# EAGLE design ads1115_2 (EAGLE 7.7.0)
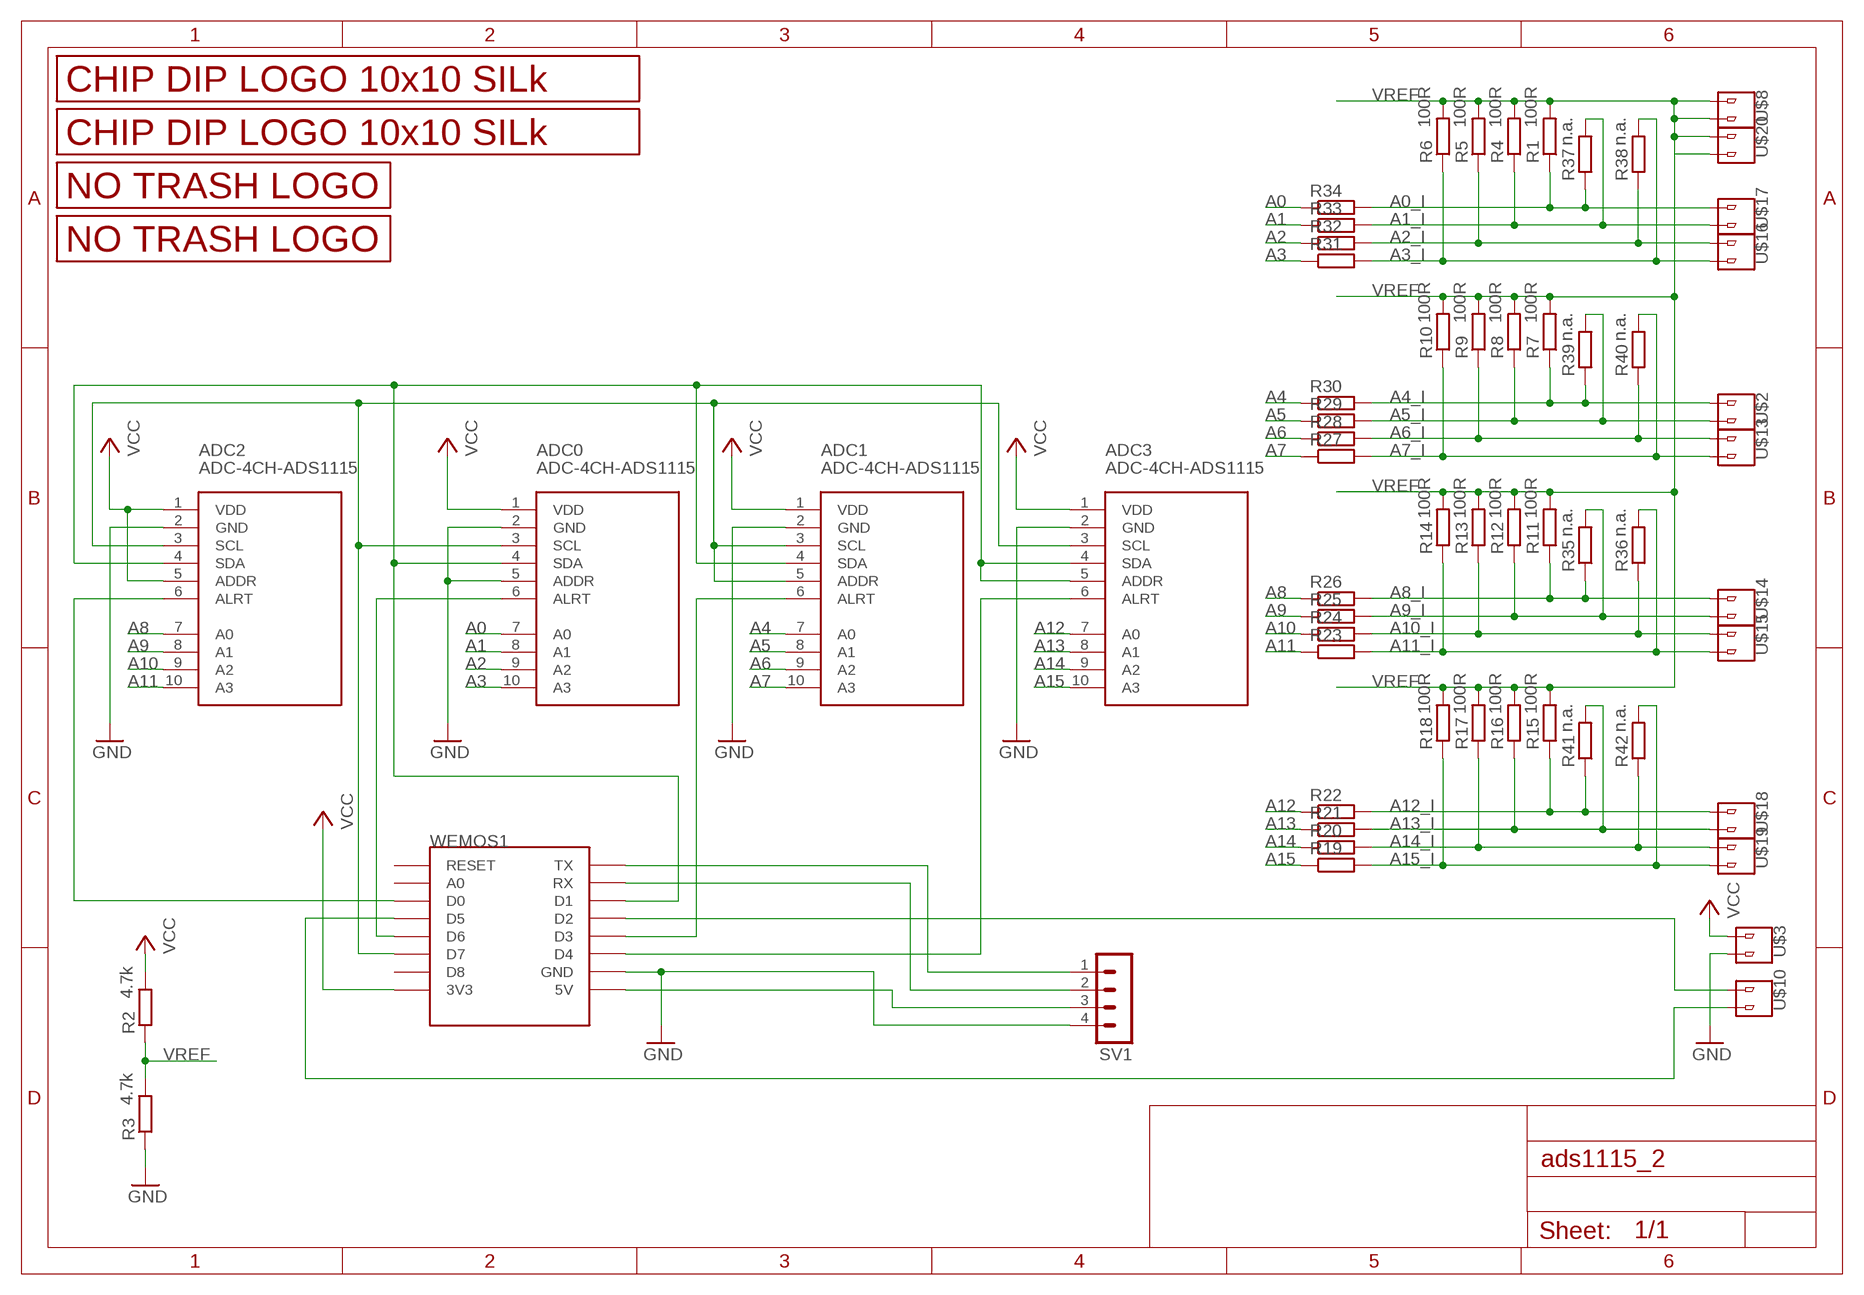
[diagram p0: schematic, sheet 1]

## Parts
ADC0  ADC-4CH-ADS1115  [ADC-4CH-ADS1115_NO]
ADC1  ADC-4CH-ADS1115  [ADC-4CH-ADS1115_NO]
ADC2  ADC-4CH-ADS1115  [ADC-4CH-ADS1115_NO]
ADC3  ADC-4CH-ADS1115  [ADC-4CH-ADS1115_NO]
R1  100R  R-EU_M0805  [M0805]
R2  4.7k  R-EU_M0805  [M0805]
R3  4.7k  R-EU_M0805  [M0805]
R4  100R  R-EU_M0805  [M0805]
R5  100R  R-EU_M0805  [M0805]
R6  100R  R-EU_M0805  [M0805]
R7  100R  R-EU_M0805  [M0805]
R8  100R  R-EU_M0805  [M0805]
R9  100R  R-EU_M0805  [M0805]
R10  100R  R-EU_M0805  [M0805]
R11  100R  R-EU_M0805  [M0805]
R12  100R  R-EU_M0805  [M0805]
R13  100R  R-EU_M0805  [M0805]
R14  100R  R-EU_M0805  [M0805]
R15  100R  R-EU_M0805  [M0805]
R16  100R  R-EU_M0805  [M0805]
R17  100R  R-EU_M0805  [M0805]
R18  100R  R-EU_M0805  [M0805]
R19  1k  R-EU_M0805  [M0805]
R20  1k  R-EU_M0805  [M0805]
R21  1k  R-EU_M0805  [M0805]
R22  1k  R-EU_M0805  [M0805]
R23  1k  R-EU_M0805  [M0805]
R24  1k  R-EU_M0805  [M0805]
R25  1k  R-EU_M0805  [M0805]
R26  1k  R-EU_M0805  [M0805]
R27  1k  R-EU_M0805  [M0805]
R28  1k  R-EU_M0805  [M0805]
R29  1k  R-EU_M0805  [M0805]
R30  1k  R-EU_M0805  [M0805]
R31  1k  R-EU_M0805  [M0805]
R32  1k  R-EU_M0805  [M0805]
R33  1k  R-EU_M0805  [M0805]
R34  1k  R-EU_M0805  [M0805]
R35  n.a.  R-EU_M0805  [M0805]
R36  n.a.  R-EU_M0805  [M0805]
R37  n.a.  R-EU_M0805  [M0805]
R38  n.a.  R-EU_M0805  [M0805]
R39  n.a.  R-EU_M0805  [M0805]
R40  n.a.  R-EU_M0805  [M0805]
R41  n.a.  R-EU_M0805  [M0805]
R42  n.a.  R-EU_M0805  [M0805]
SV1  MA04-1  [MA04-1]
U$1  LOGO_10X10_SILK  [LOGO2_10X10_SILK]
U$2  V1  2_PIN_CONNECTOR  [2_SCREW_PIN]
U$3  V1  2_PIN_CONNECTOR  [2_SCREW_PIN]
U$4  LOGO_NO_TRASHNO_TRASH  [LOGO_ROHS_NO_TRASH]
U$8  V1  2_PIN_CONNECTOR  [2_SCREW_PIN]
U$9  LOGO_NO_TRASHROHS  [LOGO_ROHS_SYM]
U$10  V1  2_PIN_CONNECTOR  [2_SCREW_PIN]
U$11  LOGO_10X10_SILK  [LOGO2_10X10_SILK]
U$13  V1  2_PIN_CONNECTOR  [2_SCREW_PIN]
U$14  V1  2_PIN_CONNECTOR  [2_SCREW_PIN]
U$15  V1  2_PIN_CONNECTOR  [2_SCREW_PIN]
U$16  V1  2_PIN_CONNECTOR  [2_SCREW_PIN]
U$17  V1  2_PIN_CONNECTOR  [2_SCREW_PIN]
U$18  V1  2_PIN_CONNECTOR  [2_SCREW_PIN]
U$19  V1  2_PIN_CONNECTOR  [2_SCREW_PIN]
U$20  V1  2_PIN_CONNECTOR  [2_SCREW_PIN]
WEMOS1  WEMOS-D1-MINITXT  [WEMOS-D1-MINI]

## Nets
A0: ADC0.7(A0) R34.1
A0_I: R1.1 R34.2 R37.1 U$17.P$1
A1: ADC0.8(A1) R33.1
A1_I: R4.1 R33.2 R37.2 U$17.P$2
A2: ADC0.9(A2) R32.1
A2_I: R5.1 R32.2 R38.1 U$16.P$1
A3: ADC0.10(A3) R31.1
A3_I: R6.1 R31.2 R38.2 U$16.P$2
A4: ADC1.7(A0) R30.1
A4_I: R7.1 R30.2 R39.1 U$2.P$1
A5: ADC1.8(A1) R29.1
A5_I: R8.1 R29.2 R39.2 U$2.P$2
A6: ADC1.9(A2) R28.1
A6_I: R9.1 R28.2 R40.1 U$13.P$1
A7: ADC1.10(A3) R27.1
A7_I: R10.1 R27.2 R40.2 U$13.P$2
A8: ADC2.7(A0) R26.1
A8_I: R11.1 R26.2 R35.1 U$14.P$1
A9: ADC2.8(A1) R25.1
A9_I: R12.1 R25.2 R35.2 U$14.P$2
A10: ADC2.9(A2) R24.1
A10_I: R13.1 R24.2 R36.1 U$15.P$1
A11: ADC2.10(A3) R23.1
A11_I: R14.1 R23.2 R36.2 U$15.P$2
A12: ADC3.7(A0) R22.1
A12_I: R15.1 R22.2 R41.1 U$18.P$1
A13: ADC3.8(A1) R21.1
A13_I: R16.1 R21.2 R41.2 U$18.P$2
A14: ADC3.9(A2) R20.1
A14_I: R17.1 R20.2 R42.1 U$19.P$1
A15: ADC3.10(A3) R19.1
A15_I: R18.1 R19.2 R42.2 U$19.P$2
GND: ADC0.2(GND) ADC0.5(ADDR) ADC1.2(GND) ADC2.2(GND) ADC3.2(GND) R3.1 SV1.4 U$3.P$2 WEMOS1.GND
N$1: SV1.1 WEMOS1.TX
N$2: SV1.2 WEMOS1.RX
N$3: SV1.3 WEMOS1.5V
N$4: ADC0.6(ALRT) WEMOS1.D6
N$5: U$10.P$2 WEMOS1.D5
N$7: U$10.P$1 WEMOS1.D2
N$9: ADC0.4(SDA) ADC1.4(SDA) ADC2.4(SDA) ADC3.4(SDA) ADC3.5(ADDR) WEMOS1.D1
N$10: ADC3.6(ALRT) WEMOS1.D4
N$12: ADC1.6(ALRT) WEMOS1.D3
N$13: ADC0.3(SCL) ADC1.3(SCL) ADC1.5(ADDR) ADC2.3(SCL) ADC3.3(SCL) WEMOS1.D7
N$15: ADC2.6(ALRT) WEMOS1.D0
VCC: ADC0.1(VDD) ADC1.1(VDD) ADC2.1(VDD) ADC2.5(ADDR) ADC3.1(VDD) R2.2 U$3.P$1 WEMOS1.3V3
VREF: R1.2 R2.1 R3.2 R4.2 R5.2 R6.2 R7.2 R8.2 R9.2 R10.2 R11.2 R12.2 R13.2 R14.2 R15.2 R16.2 R17.2 R18.2 U$8.P$1 U$8.P$2 U$20.P$1 U$20.P$2
Unconnected: WEMOS1.A0 WEMOS1.D8 WEMOS1.RESET

## Library data of the parts
ADC0 ADC1-ADC3 = diy-modules:ADC-4CH-ADS1115: 4 Channel 16-Bit Analog-to-Digital Converter based on ADS1115 chip Arduino ADS1115 Getting Started Tutorial is available here: http://henrysbench.capnfatz.com/henrys-bench/arduino-voltage-measurements/arduino-ads1115-module-getting-started-tutorial/ ADS1115 datasheet is available here: http://www.ti.com/lit/ds/symlink/ads1115.pdf Click here to find device on ebay.com <http://www.ebay.com/sch/ads1115+module>
R1-R42 = rcl:R-EU_: RESISTOR, European symbol
SV1 = con-lstb:MA04-1: PIN HEADER; OC_FARNELL: unknown; OC_NEWARK: unknown
U$1 U$11 = JKW_CHIP:LOGO_10X10_SILK
U$2 U$3 U$8 U$10 U$13-U$20 = JKW_CHIP:2_PIN_CONNECTOR
U$4 U$9 = JKW_CHIP:LOGO_NO_TRASH
WEMOS1 = esp8266modules:WEMOS-D1-MINI: WeMos.cc D1 mini ESP8266 module

## Board
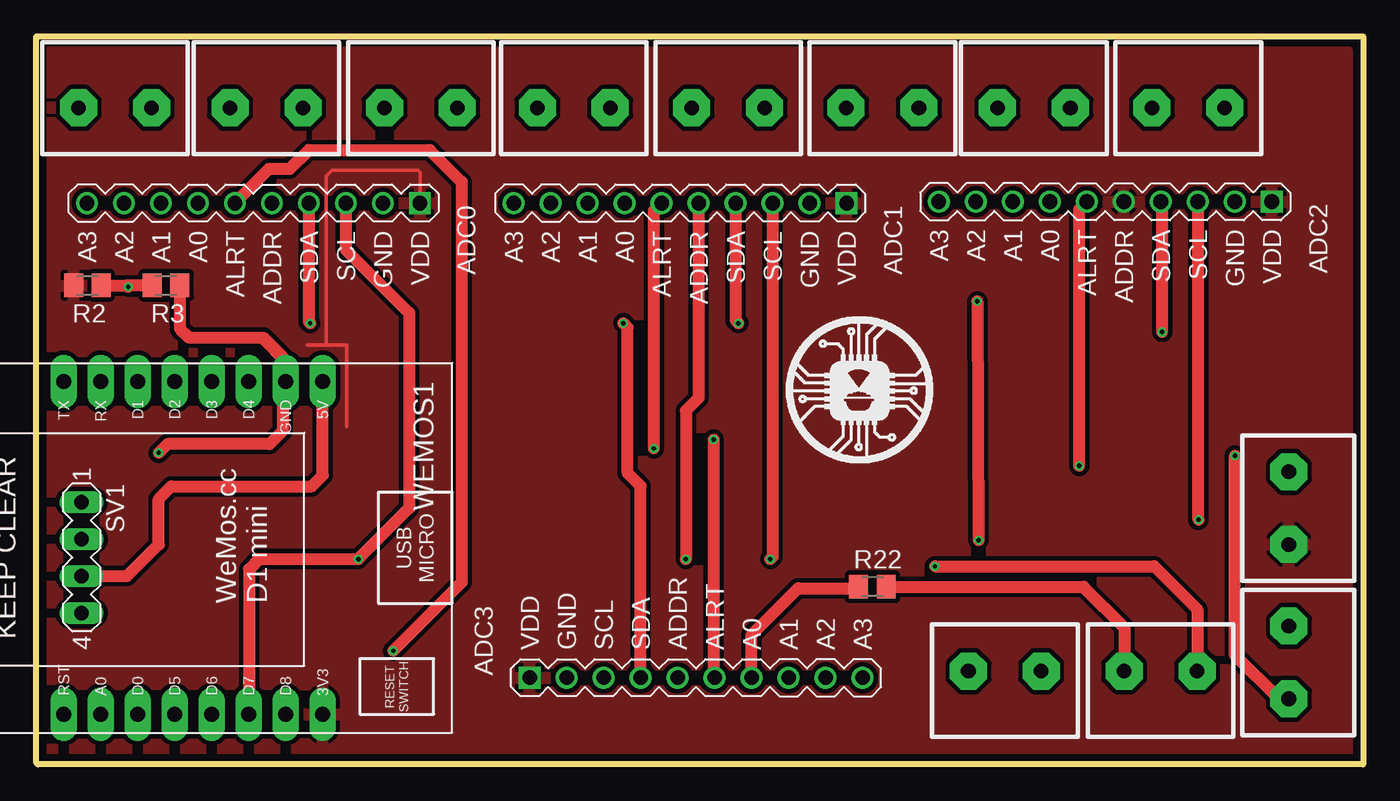
[diagram p1: board, top side]
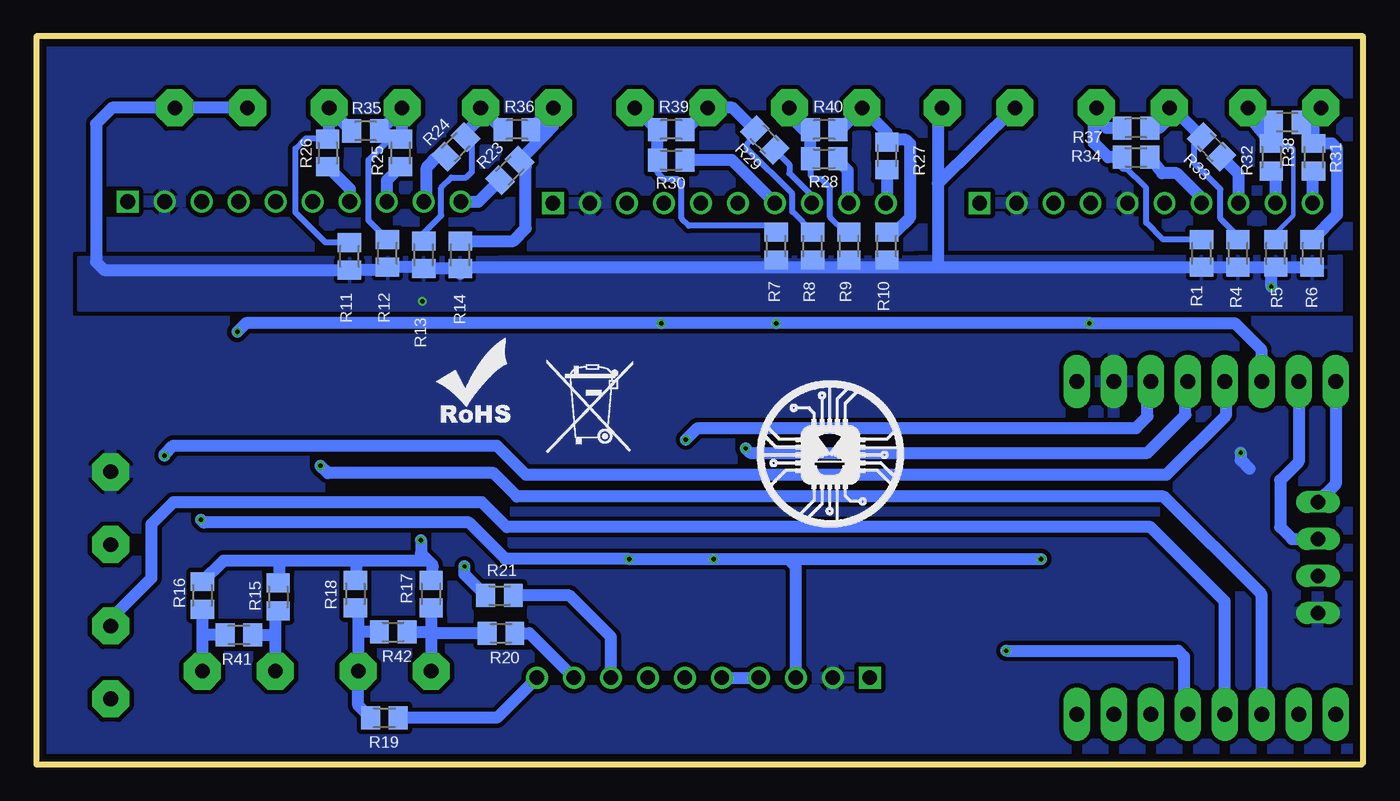
[diagram p2: board, bottom side, seen from below]

Size 91.1 x 50 mm. Coordinates in mm from the lower left corner, seen from the top.
Outline: 0,0.1 0,50 91.1,50 91.1,0 0.1,0
Copper layers (1*16): Top 0.035mm / dielectric 1.6mm / Bottom 0.035mm
Design rules "Elecrow_2-layer_PCB_eagle_rule": minimum track width 6mil, minimum drill 12mil, track to track 6mil, track to pad 6mil, pad to pad 6mil, via to via 8mil, smd to smd 0mil, copper to edge 20mil, drill to drill 10mil, minimum pad ring 6mil, minimum via ring 6mil, stop-mask expansion 0mil, vias tented up to drill 100mil, thermal gap 10mil

### Footprints (pad centres in the part's own frame; a part is rotated, then mirrored left to right if it is on the bottom)
ADC-4CH-ADS1115_NO = drill 1 square: 1 -6.35,11.43 | drill 1: 2 -6.35,8.89; 3 -6.35,6.35; 4 -6.35,3.81; 5 -6.35,1.27; 6 -6.35,-1.27; 7 -6.35,-3.81; 8 -6.35,-6.35; 9 -6.35,-8.89; 10 -6.35,-11.43
M0805 = smd 1.3 x 1.6: 1 -0.95,0; 2 0.95,0
MA04-1 = drill 1.016 long: 1 -3.81,0; 2 -1.27,0; 3 1.27,0; 4 3.81,0
2_SCREW_PIN = drill 1 pad 2.54 octagon: P$1 -2.5,0.5; P$2 2.5,0.5
WEMOS-D1-MINI = drill 1.016 pad 1.829 long: 3V3 -10.16,-10.16; 5V 12.7,-10.16; A0 -10.16,5.08; D0 -10.16,2.54; D1 12.7,2.54; D2 12.7,0; D3 12.7,-2.54; D4 12.7,-5.08; D5 -10.16,0; D6 -10.16,-2.54; D7 -10.16,-5.08; D8 -10.16,-7.62; GND 12.7,-7.62; RESET -10.16,7.62; RX 12.7,5.08; TX 12.7,7.62

### Placement (x,y rotation side)
ADC0  14.9,32.2 270 top
ADC1  44.2,32.2 270 top
ADC2  73.4,32.3 270 top
ADC3  45.3,12.3 90 top
R1  11.1,35.1 270 bottom
R2  3.5,32.9 180 top
R3  8.9,32.9 180 top
R4  8.6,35.1 270 bottom
R5  6,35.1 270 bottom
R6  3.5,35.1 270 bottom
R7  40.3,35.6 270 bottom
R8  37.8,35.6 270 bottom
R9  35.3,35.6 270 bottom
R10  32.7,35.6 270 bottom
R11  69.6,34.9 270 bottom
R12  67,35.1 270 bottom
R13  64.5,35 270 bottom
R14  62,35 270 bottom
R15  74.5,11.5 90 bottom
R16  79.7,11.6 90 bottom
R17  64,11.7 90 bottom
R18  69.2,11.7 90 bottom
R19  67.2,3.2 180 bottom
R20  59.2,9 180 bottom
R21  59.3,11.6 180 bottom
R22  57.4,12.2 0 top
R23  58.6,40.8 45 bottom
R24  62.3,42.4 45 bottom
R25  66.1,42 90 bottom
R26  71.1,42 90 bottom
R27  32.7,41.8 90 bottom
R28  37,41.6 180 bottom
R29  41.1,42.9 135 bottom
R30  47.5,41.5 180 bottom
R31  3.4,41.7 90 bottom
R32  6.3,41.7 90 bottom
R33  10.4,42.4 135 bottom
R34  15.6,41.7 180 bottom
R35  68.5,43.5 0 bottom
R36  58.1,43.6 0 bottom
R37  15.6,43.7 0 bottom
R38  5.2,44.1 0 bottom
R39  47.5,43.6 0 bottom
R40  37,43.6 0 bottom
R41  77.2,8.9 180 bottom
R42  66.6,9.1 180 bottom
SV1  3.1,14.2 270 top
U$1  41.6,16.3 0 bottom
U$2  47.5,45.6 180 top
U$3  86.5,17.6 90 top
U$4  56.1,21.4 0 bottom
U$8  26.4,45.6 180 top
U$9  64.1,23.4 0 bottom
U$10  86.5,7 90 top
U$11  51.5,20.7 0 top
U$13  36.9,45.6 180 top
U$14  68.5,45.6 180 top
U$15  58.1,45.6 180 top
U$16  5.4,45.6 180 top
U$17  15.8,45.6 180 top
U$18  77.2,5.9 0 top
U$19  66.5,5.9 0 top
U$20  79.1,45.6 180 top
WEMOS1  9.5,13.6 90 top

### Tracks (layer width: path | path; a pad name or v marks a point on that pad's centre or on a via)
A0
  Bottom 0.813: ADC0.7 11.09,38.89 12.8,40.6 13.8,40.6 R34.1
A0_I
  Bottom 0.406: R1.1 13.75,36.05 14.9,37.2 14.9,39.6 16.4,41.1
  Bottom 0.813: 18.5,44.6 18.5,42.7 17.5,41.7 R34.2 16.55,41.25 16.4,41.1 | 18.5,44.6 18.5,44.9 U$17.P$1 | R37.1 17.6,43.7 18.5,44.6
A1
  Bottom 0.813: ADC0.8 8.55,40.55 R33.1
A1_I
  Bottom 0.406: R4.1 8.6,36.3 9.8,37.5 9.8,39.5 11.6,41.3 11.6,42.54 R33.2
  Bottom 0.813: U$17.P$2 13.1,45.1 12.85,44.85 | 12.85,44.85 R33.2 | R37.2 14,43.7 12.85,44.85
A2
  Bottom 0.813: ADC0.9 6.01,40.74 R32.1
A2_I
  Bottom 0.305: R5.1 6,36.5 4.8,37.7 4.8,42.3 5,42.5 5.85,42.5 R32.2
  Bottom 0.813: U$16.P$1 7.9,44.55 7.52,44.17 | 7.52,44.17 R32.2 | R38.1 7.4,44.3 7.52,44.17
A3
  Bottom 0.813: ADC0.10 3.47,40.68 R31.1
A3_I
  Bottom 0.813: 3.4,44.3 R31.2 2.15,42.65 1.8,42.3 1.8,37.75 R6.1 | 3.4,44.3 3.4,44.6 U$16.P$2 | R38.2 3.4,44.3
A4
  Bottom 0.813: 40.3,38.46 ADC1.7 43.34,41.5 R30.1
A4_I
  Bottom 0.406: R7.1 40.75,37 46.3,37 46.8,37.5 46.8,39.9 47.1,40.2 48,40.2 48.45,40.65 R30.2
  Bottom 0.813: U$2.P$1 48.5,43.6 R39.1 R30.2
A5
  Bottom 0.406: R29.1 39.4,41.2 39.4,40.6 37.85,39.05 ADC1.8
  Bottom 0.813: 37.8,38.5 ADC1.8
A5_I
  Bottom 0.406: R8.1 39.2,37.95 39.2,39.2 42.3,42.3 42.3,42.6 41.77,43.13 R29.2
  Bottom 0.813: R39.2 46.5,43.6 U$2.P$2 | 44.2,45.1 U$2.P$2 | R29.2 43.3,45.1 U$2.P$2
A6
  Bottom 0.813: ADC1.9 35.4,38.64 35.4,40.8 36.05,41.45 R28.1
A6_I
  Bottom 0.406: R9.1 35.55,36.55 36.6,37.6 36.6,39.6 37.2,40.2 37.7,40.2 37.9,40.4 37.9,41.55 R28.2
  Bottom 0.813: R28.2 37.95,43.1 | 37.95,43.1 R40.1 | U$13.P$1 39.4,44.55 37.95,43.1
A7
  Bottom 0.813: 32.7,38.48 ADC1.10 32.7,38.62 R27.1
A7_I
  Bottom 0.813: R10.1 32.15,36.55 31.1,37.6 31.1,42.6 31.4,42.9 32.55,42.9 R27.2 32.7,43.4 U$13.P$2 35.9,43.6 R40.2
A8
  Bottom 0.813: R26.1 69.59,39.54 ADC2.7
A8_I
  Bottom 0.406: R11.1 71.25,35.85 73.3,37.9 73.3,42.3 72.6,43 71.15,43 R26.2
  Bottom 0.813: R35.1 71,45.05 U$14.P$1 71,43.05 R26.2
A9
  Bottom 0.813: R25.1 67.05,40.1 ADC2.8
A9_I
  Bottom 0.406: R12.1 68.3,37.35 68.3,41.5 67.1,42.7 67.1,43.05 R35.2
  Bottom 0.813: R35.2 66,45.05 U$14.P$2 66,43.05 R25.2
A10
  Bottom 0.813: ADC2.9 64.3,38.86 64.3,41 63.57,41.73 R24.1
A10_I
  Bottom 0.406: R13.1 64.5,36.5 63.3,37.7 63.3,39.6 62.6,40.3 61.6,40.3 61.2,40.7 61.2,42.64 R24.2
  Bottom 0.813: R36.1 59.1,43.6 60.25,44.75 | 60.25,44.75 U$15.P$1 | R24.2 61.63,43.37 60.25,44.75
A11
  Bottom 0.813: ADC2.10 60.75,38.65 R23.1
A11_I
  Bottom 0.813: U$15.P$2 55.6,43.9 | 55.6,43.9 R23.2 57.5,41.04 57.5,36.8 58.35,35.95 R14.1 | 55.6,43.9 56,43.5 56.2,43.5 55.6,44.1 55.6,45.2 57.15,43.65 R36.2
A12
  Top 0.813: ADC3.7 49.11,8.91 52.3,12.1 56.35,12.1 R22.1
A12_I
  Top 0.813: R22.2 71.9,12.2 74.7,9.4 U$18.P$1
  Bottom 0.813: R15.1 74.7,10.35 74.7,8.7 | 74.7,8.7 U$18.P$1 | R41.1 74.9,8.9 74.7,8.7
A13
  Bottom 0.813: ADC3.8 51.65,8.75 54.5,11.6 R21.1
A13_I  (via drill 0.3)
  Top 0.813: v61.7,13.6 76.75,13.6 R16.1 U$18.P$2
  Bottom 0.813: R16.1 79.7,8.7 | 79.7,8.7 U$18.P$2 | R21.2 61.7,13.05 v61.7,13.6 | R41.2 79.5,8.9 79.7,8.7
A14
  Bottom 0.813: R20.1 57.24,9 ADC3.9
A14_I
  Bottom 0.813: R17.1 64,9.2 | 64,9.2 64,9 | 64,9 U$19.P$1 | R20.2 64,9 | R42.1 64.1,9.1 64,9.2
A15
  Bottom 0.813: ADC3.10 59.48,3.2 R19.1
A15_I
  Bottom 0.813: R18.1 69,10.55 69,9.1 | 69,9.1 U$19.P$2 69,4.05 R19.2 | R42.2 69,9.1
GND  (via drill 0.3)
  Top 0.813: R3.1 9.85,29.95 10.5,29.3 15.5,29.3 | 15.5,29.3 17.12,27.68 WEMOS1.GND | 15.5,29.3 15.6,29.3 16.9,28 16.9,22.9 16,22 9,22 v8.4,21.4
  Bottom 0.813: v8.4,21.4 8.4,20.9 7.8,20.3
  pour Bottom (isolate 0.305, rank 2): 0.6,0.6 0.6,49.3 90.4,49.3 90.4,0.7 1.4,0.7
N$1
  Bottom 0.813: WEMOS1.TX 1.88,19.23 SV1.1
N$2
  Bottom 0.813: WEMOS1.RX 4.42,20.78 5.7,19.5 5.7,16.3 4.87,15.47 SV1.2
N$3
  Top 0.813: WEMOS1.5V 19.66,19.86 18.9,19.1 9.27,19.1 8.4,18.23 8.4,15.1 6.23,12.93 SV1.3
N$4  (via drill 0.3)
  Top 0.813: 24.6,7.9 v24.5,7.8 29.2,12.5 29.2,40 27,42.2 18.7,42.2 17.4,40.9 15.98,40.9 ADC0.6
  Bottom 0.813: v24.5,7.8 12.7,7.8 12.3,7.4 12.3,3.7 WEMOS1.D6
N$5
  Bottom 0.813: WEMOS1.D5 9.5,11.2 14.6,16.3 58.8,16.3 60.5,18 81.7,18 83.2,16.5 83.2,12.8 86,10 U$10.P$2
N$7  (via drill 0.3)
  Top 0.813: U$10.P$1 85.3,4.5 82.3,7.5 v82.3,21.2
  Bottom 0.813: v82.3,21.2 82.3,21.3 81.7,21.9 59.5,21.9 57.5,19.9 13.5,19.9 9.4,24 9.4,26.2 WEMOS1.D2
N$9  (via drill 0.3)
  Top 0.813: v77.3,29.7 77.3,38.56 ADC2.4 | 7.1,26.44 WEMOS1.D1 | ADC3.4 41.49,19.11 40.6,20 40.6,30 v40.3,30.3 | ADC1.4 48.01,30.49 v48.2,30.3 | ADC0.4 18.71,30.39 v18.8,30.3
  Bottom 0.813: 18.7,30.3 v18.8,30.3 | v18.8,30.3 v40.3,30.3 v48.2,30.3 76.7,30.3 v77.3,29.7 | ADC3.5 ADC3.4 | 18.71,30.31 14.2,30.31 | 14.2,30.31 8.81,30.31 7,28.5 7,26.34 WEMOS1.D1 | v18.8,30.3 14.21,30.3 14.2,30.31
N$10  (via drill 0.3)
  Top 0.813: v46.5,22.3 46.5,6.02 ADC3.6
  Bottom 0.813: v46.5,22.3 45.7,23.1 15.6,23.1 14.8,23.9 14.8,26.08 WEMOS1.D4
N$12  (via drill 0.3)
  Top 0.813: v42.4,21.7 42.4,38.02 ADC1.6
  Bottom 0.813: v42.4,21.7 42.1,21.4 14.8,21.4 12.2,24 12.2,26.14 WEMOS1.D3
N$13  (via drill 0.3)
  Top 0.813: ADC0.3 21.25,35.35 25.6,31 25.6,17.6 v22.1,14.1 | 22.2,14.2 v22.1,14.1 | WEMOS1.D7 14.6,3.46 14.6,13.4 15.3,14.1 v22.1,14.1 | ADC1.3 50.55,14.25 v50.4,14.1 | v79.8,16.8 79.8,38.6 ADC2.3 | ADC1.5 45.47,25.17 44.6,24.3 v44.6,14.1
  Bottom 0.813: 39.5,14.1 v44.6,14.1 v50.4,14.1 58.9,14.1 61.4,16.6 79.6,16.6 v79.8,16.8 | 39.5,14.1 v22.1,14.1 | ADC3.3 38.95,13.55 39.5,14.1
N$15  (via drill 0.3)
  Top 0.813: v71.6,20.5 71.6,38.12 ADC2.6
  Bottom 0.813: v71.6,20.5 71.1,20 59.7,20 58.1,18.4 13.7,18.4 6.96,11.66 WEMOS1.D0
VCC
  Top 0.254: 21.3,23.2 21.3,28.8 19.8,28.8 | 19.8,28.8 18.6,28.8 | ADC0.1 26.33,40.67 26.2,40.8 20.3,40.8 19.9,40.4 19.9,28.9 19.8,28.8
  pour Top (isolate 0.305): 0.8,0.6 0.8,49 90,49 90,0.8 1.3,0.8
VREF  (via drill 0.3)
  Top 0.813: v64.6,31.8 v64.7,15.4 | R2.1 6.2,32.9 v6.3,32.8 6.4,32.9 R3.2
  Bottom 0.813: R14.2 61.9,34.15 40.4,34.15 | 40.4,34.15 37.6,34.15 | 37.6,34.15 35.1,34.15 | 35.1,34.15 32.5,34.15 | 32.5,34.15 29.2,34.15 | 29.2,34.15 R1.2 R4.2 6.5,34.15 | 6.5,34.15 R5.2 R6.2 | U$8.P$2 29.2,39.9 | 29.2,39.9 29.2,34.15 | U$8.P$1 29.2,44.9 29.2,39.9 | R14.2 62,33.7 | R13.2 64.5,34.1 | U$20.P$2 U$20.P$1 85.9,45.1 87,44 87,34.5 86.45,33.95 R11.2 67.45,33.95 67.2,34.2 67.05,34.2 R12.2 64.6,34.15 R13.2 | R14.2 R13.2 | 64.2,14 64.7,14.5 v64.7,15.4 | 64.2,14 63.9,13.7 R17.2 | R16.2 78.25,14 74.4,14 | 74.4,14 69.1,14 | 69.1,14 64.2,14 | R18.2 69.1,12.75 69.1,14 | R15.2 74.4,12.55 74.4,14 | v6.3,32.8 6.3,33.95 6.5,34.15 | R7.2 40.3,34.25 40.4,34.15 | R10.2 32.7,34.35 32.5,34.15 | R9.2 35.3,34.35 35.1,34.15 | R8.2 37.8,34.35 37.6,34.15
  pour Bottom (isolate 0.305): 1.7,34.9 88.2,34.8 88.2,31.2 1.5,31.2 1.5,34.9

### Text on the board
tValues: ADS JKW V1 2020
bValues: A2/3 | A0/1 | AREF | A6/7 | A4/5 | A10/11 | A8/9 | AREF | VCC/GND | D2/D5